# Altium schematic sheet ES_PRJ_6C_2L_2026.SchDoc: =SchTitle
size 276 x 198 mm; Organization: ETML-ES; Address1: Av. Recordon 1bis; Address2: CH - 1004 Lausanne; Address3: Tél. 021 316 77 77; Address4: www.etml-es.ch; SheetNumber: 1; SheetTotal: 1; Replace: .; ModA: .; ModB: .; ModC: .; ModD: .
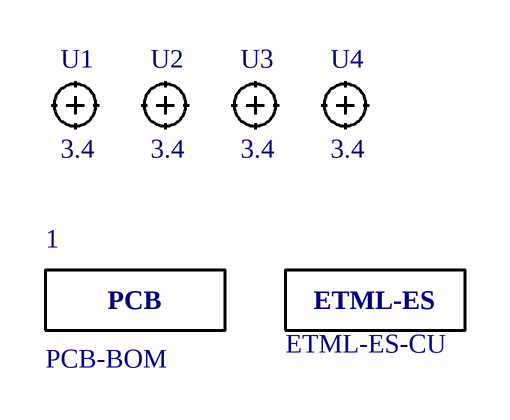
[diagram p0: ES_PRJ_6C_2L_2026.SchDoc]

## Parts
0  ETML-ES-CU  [ETML-ES-CU-Footprint-1]  (no BOM)
1  PCB-BOM  (mechanical)
U1  3.4  [MECH-UHD340]  (no BOM)
U2  3.4  [MECH-UHD340]  (no BOM)
U3  3.4  [MECH-UHD340]  (no BOM)
U4  3.4  [MECH-UHD340]  (no BOM)

## Notes on the sheet
- a
- Dessiné
- A4
- Echelle :
- Mod.
- b
- c
- d
- Contrôlé
- Remplace
- Nb. feuilles
- Feuille n°
- Nom du projet
- No
- (in symbol CMP-063-000030-2) ETML-ES
- (in symbol CMP-064-000001-1) PCB

## Library data of the parts
0 = CMP-063-000030-2: Logo ETML-ES; IsStocked: Fasle; Value: ETML-ES-CU; Category: Others; SubCategory: Dessins
1 = CMP-064-000001-1: PCB element for BOM; IsStocked: False; PN: PN-108075; Category: Others; SubCategory: Dessins; Supplier Price 1: 0; Supplier 1: Eurocircuits Sàrl; Value: PCB-BOM; Supplier Part Number 1: -
U1-U4 = CMP-063-000009-1: Unplated Hole 3.4mm; PN: PN-491366; IsStocked: False; SubCategory: Mecaniques; Category: Others; Value: 3.4